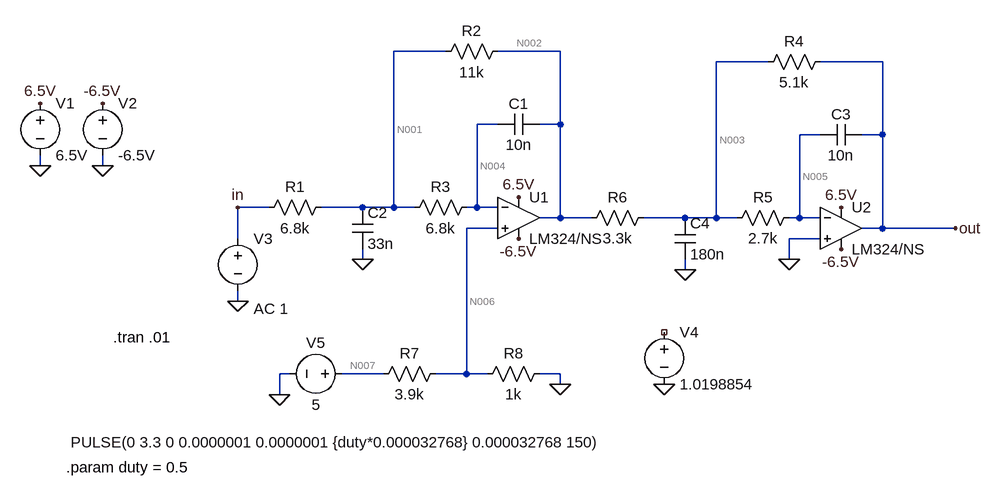
[diagram p0: schematic VCO.asc]
VCO.asc, the LTspice schematic file:
Version 4
SHEET 1 2296 768
WIRE 288 -32 208 -32
WIRE 464 -32 368 -32
WIRE 784 -16 704 -16
WIRE 960 -16 864 -16
WIRE 368 80 336 80
WIRE 464 80 464 -32
WIRE 464 80 432 80
WIRE 864 96 832 96
WIRE 960 96 960 -16
WIRE 960 96 928 96
WIRE -336 144 -336 128
WIRE -240 144 -240 128
WIRE 16 208 -32 208
WIRE 160 208 96 208
WIRE 208 208 208 -32
WIRE 208 208 160 208
WIRE 240 208 208 208
WIRE 336 208 336 80
WIRE 336 208 320 208
WIRE 368 208 336 208
WIRE 464 224 464 80
WIRE 464 224 432 224
WIRE 512 224 464 224
WIRE 656 224 592 224
WIRE 704 224 704 -16
WIRE 704 224 656 224
WIRE 736 224 704 224
WIRE 832 224 832 96
WIRE 832 224 816 224
WIRE 864 224 832 224
WIRE 368 240 320 240
WIRE 960 240 960 96
WIRE 960 240 928 240
WIRE 1072 240 960 240
WIRE -32 256 -32 208
WIRE 864 256 816 256
WIRE 160 288 160 272
WIRE 816 288 816 256
WIRE 656 304 656 288
WIRE -32 352 -32 336
WIRE 48 464 32 464
WIRE 192 464 128 464
WIRE 320 464 320 240
WIRE 320 464 272 464
WIRE 352 464 320 464
WIRE 464 464 432 464
WIRE 464 480 464 464
WIRE 32 496 32 464
FLAG -240 144 0
FLAG -336 144 0
FLAG -240 48 -6.5V
FLAG 400 256 -6.5V
FLAG 160 288 0
FLAG -32 352 0
FLAG -32 208 in
FLAG 896 272 -6.5V
FLAG 656 304 0
FLAG 1072 240 out
FLAG 816 288 0
FLAG 464 480 0
FLAG -336 48 6.5V
FLAG 400 192 6.5V
FLAG 896 208 6.5V
FLAG 624 480 0
FLAG 32 496 0
SYMBOL ZZZ\\OpAmp\\LM324 400 224 R0
SYMATTR InstName U1
SYMBOL voltage -336 32 R0
WINDOW 123 0 0 Left 0
WINDOW 39 0 0 Left 0
SYMATTR InstName V1
SYMATTR Value 6.5V
SYMBOL voltage -240 32 R0
WINDOW 123 0 0 Left 0
WINDOW 39 0 0 Left 0
SYMATTR InstName V2
SYMATTR Value -6.5V
SYMBOL cap 432 64 R90
WINDOW 0 0 32 VBottom 2
WINDOW 3 32 32 VTop 2
SYMATTR InstName C1
SYMATTR Value 10n
SYMBOL res 384 -48 R90
WINDOW 0 0 56 VBottom 2
WINDOW 3 32 56 VTop 2
SYMATTR InstName R2
SYMATTR Value 11k
SYMBOL res 336 192 R90
WINDOW 0 0 56 VBottom 2
WINDOW 3 32 56 VTop 2
SYMATTR InstName R3
SYMATTR Value 6.8k
SYMBOL cap 144 208 R0
SYMATTR InstName C2
SYMATTR Value 33n
SYMBOL res 0 224 R270
WINDOW 0 32 56 VTop 2
WINDOW 3 0 56 VBottom 2
SYMATTR InstName R1
SYMATTR Value 6.8k
SYMBOL voltage -32 240 R0
WINDOW 3 -257 329 Left 2
WINDOW 123 24 124 Left 2
WINDOW 39 0 0 Left 0
SYMATTR Value PULSE(0 3.3 0 0.0000001 0.0000001 {duty*0.000032768} 0.000032768 150)
SYMATTR Value2 AC 1
SYMATTR InstName V3
SYMBOL ZZZ\\OpAmp\\LM324 896 240 R0
SYMATTR InstName U2
SYMBOL cap 928 80 R90
WINDOW 0 0 32 VBottom 2
WINDOW 3 32 32 VTop 2
SYMATTR InstName C3
SYMATTR Value 10n
SYMBOL res 880 -32 R90
WINDOW 0 0 56 VBottom 2
WINDOW 3 32 56 VTop 2
SYMATTR InstName R4
SYMATTR Value 5.1k
SYMBOL res 832 208 R90
WINDOW 0 0 56 VBottom 2
WINDOW 3 32 56 VTop 2
SYMATTR InstName R5
SYMATTR Value 2.7k
SYMBOL cap 640 224 R0
SYMATTR InstName C4
SYMATTR Value 180n
SYMBOL res 496 240 R270
WINDOW 0 32 56 VTop 2
WINDOW 3 0 56 VBottom 2
SYMATTR InstName R6
SYMATTR Value 3.3k
SYMBOL res 288 448 R90
WINDOW 0 0 56 VBottom 2
WINDOW 3 32 56 VTop 2
SYMATTR InstName R7
SYMATTR Value 3.9k
SYMBOL res 448 448 R90
WINDOW 0 0 56 VBottom 2
WINDOW 3 32 56 VTop 2
SYMATTR InstName R8
SYMATTR Value 1k
SYMBOL voltage 624 384 R0
WINDOW 123 0 0 Left 0
WINDOW 39 0 0 Left 0
SYMATTR InstName V4
SYMATTR Value 1.0198854
SYMBOL voltage 144 464 R90
WINDOW 0 -32 56 VBottom 2
WINDOW 3 32 56 VTop 2
WINDOW 123 0 0 Left 0
WINDOW 39 0 0 Left 0
SYMATTR InstName V5
SYMATTR Value 5
TEXT -224 408 Left 2 !.tran .01
TEXT -296 608 Left 2 !.param duty = 0.5

The netlist it stands for:
* VCO.asc
XU1 N006 N004 6.5V -6.5V N002 LM324/NS  ; pins In+ In- V+ V- OUT
V1 6.5V 0 6.5V
V2 -6.5V 0 -6.5V
C1 N002 N004 10n
R2 N002 N001 11k
R3 N004 N001 6.8k
C2 N001 0 33n
R1 in N001 6.8k
V3 in 0 PULSE(0 3.3 0 0.0000001 0.0000001 {duty*0.000032768} 0.000032768 150) AC 1
XU2 0 N005 6.5V -6.5V out LM324/NS  ; pins In+ In- V+ V- OUT
C3 out N005 10n
R4 out N003 5.1k
R5 N005 N003 2.7k
C4 N003 0 180n
R6 N002 N003 3.3k
R7 N006 N007 3.9k
R8 0 N006 1k
V4 NC_01 0 1.0198854
V5 N007 0 5
.tran .01
.param duty = 0.5
.backanno
.end

* Results of the author's LTspice run, read from the files saved beside the schematic
* Operating Point, zero values left out:
*   V(n004) = 1.022 V
*   V(n006) = 1.02 V
*   V(6.5v) = 6.5 V
*   V(-6.5v) = -6.5 V
*   V(n002) = 2.675 V
*   V(n001) = 1.022 V
*   V(n005) = 2.042 mV
*   V(out) = -4.13 V
*   V(n003) = 1.94 mV
*   V(n007) = 5 V
*   I(R8) = -1.02 mA
*   I(R7) = -1.02 mA
*   I(R6) = 810.1 µA
*   I(R5) = 37.88 nA
*   I(R4) = -810.2 µA
*   I(R1) = -150.3 µA
*   I(R3) = 37.95 nA
*   I(R2) = 150.3 µA
*   I(V5) = -1.02 mA
*   I(V3) = 150.3 µA
*   I(V2) = 778.5 µA
*   I(V1) = -928.9 µA
*   Ix(u1:1) = -51.96 nA
*   Ix(u1:2) = -37.95 nA
*   Ix(u1:99) = 944.5 µA
*   Ix(u1:50) = 15.98 µA
*   Ix(u1:28) = -960.4 µA
*   Ix(u2:1) = -52.04 nA
*   Ix(u2:2) = -37.88 nA
*   Ix(u2:99) = -15.65 µA
*   Ix(u2:50) = -794.4 µA
*   Ix(u2:28) = 810.2 µA
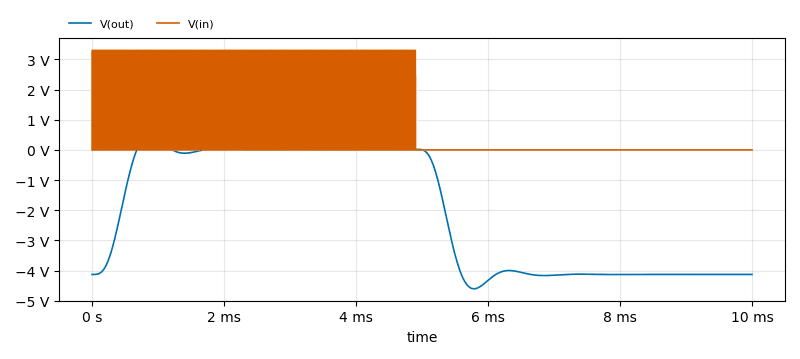
[diagram p1: Transient Analysis of VCO.asc, plotted from the saved traces]
* Transient Analysis, 1 run:
*   V(out): min -4.605 V, max 495.2 mV, average -2.09 V, rms 2.917 V, last -4.13 V
*   V(in): min 0 V, max 3.3 V, average 816 mV, rms 1.64 V, last 0 V